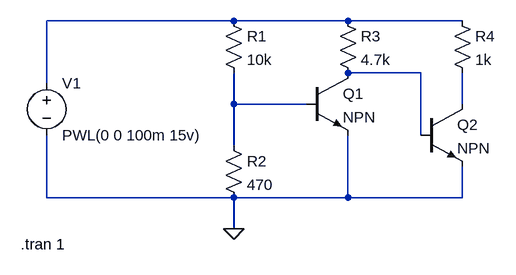
[diagram p0: schematic NPN_BJT_Overvoltage_Protection_Circuit.asc]
NPN_BJT_Overvoltage_Protection_Circuit.asc, the LTspice schematic file:
Version 4
SHEET 1 880 680
WIRE 336 64 48 64
WIRE 512 64 336 64
WIRE 688 64 512 64
WIRE 624 144 512 144
WIRE 48 160 48 64
WIRE 336 192 336 144
WIRE 448 192 336 192
WIRE 688 192 688 144
WIRE 624 240 624 144
WIRE 336 256 336 192
WIRE 48 336 48 240
WIRE 336 336 48 336
WIRE 512 336 512 240
WIRE 512 336 336 336
WIRE 688 336 688 288
WIRE 688 336 512 336
WIRE 336 384 336 336
FLAG 336 384 0
SYMBOL voltage 48 144 R0
WINDOW 123 0 0 Left 0
WINDOW 39 0 0 Left 0
SYMATTR InstName V1
SYMATTR Value PWL(0 0 100m 15v)
SYMBOL res 320 48 R0
SYMATTR InstName R1
SYMATTR Value 10k
SYMBOL res 320 240 R0
SYMATTR InstName R2
SYMATTR Value 470
SYMBOL res 496 48 R0
SYMATTR InstName R3
SYMATTR Value 4.7k
SYMBOL npn 448 144 R0
SYMATTR InstName Q1
SYMBOL res 672 48 R0
SYMATTR InstName R4
SYMATTR Value 1k
SYMBOL npn 624 192 R0
SYMATTR InstName Q2
TEXT 8 408 Left 2 !.tran 1

The netlist it stands for:
* NPN_BJT_Overvoltage_Protection_Circuit.asc
V1 N001 0 PWL(0 0 100m 15v)
R1 N001 N003 10k
R2 N003 0 470
R3 N001 N002 4.7k
Q1 N002 N003 0 0 NPN
R4 N001 N004 1k
Q2 N004 N002 0 0 NPN
.model NPN NPN
.model PNP PNP
.lib standard.bjt
.tran 1
.backanno
.end